# EAGLE schematic espurna-h (EAGLE 8.3.2)
PROJECT_AUTHOR: tinkerman.cat <xose.perez@gmail.com>; PROJECT_LICENSE: CC-BY-SA 4.0; PROJECT_NAME: ESPURNA-H; PROJECT_VERSION: 0.7.20170913
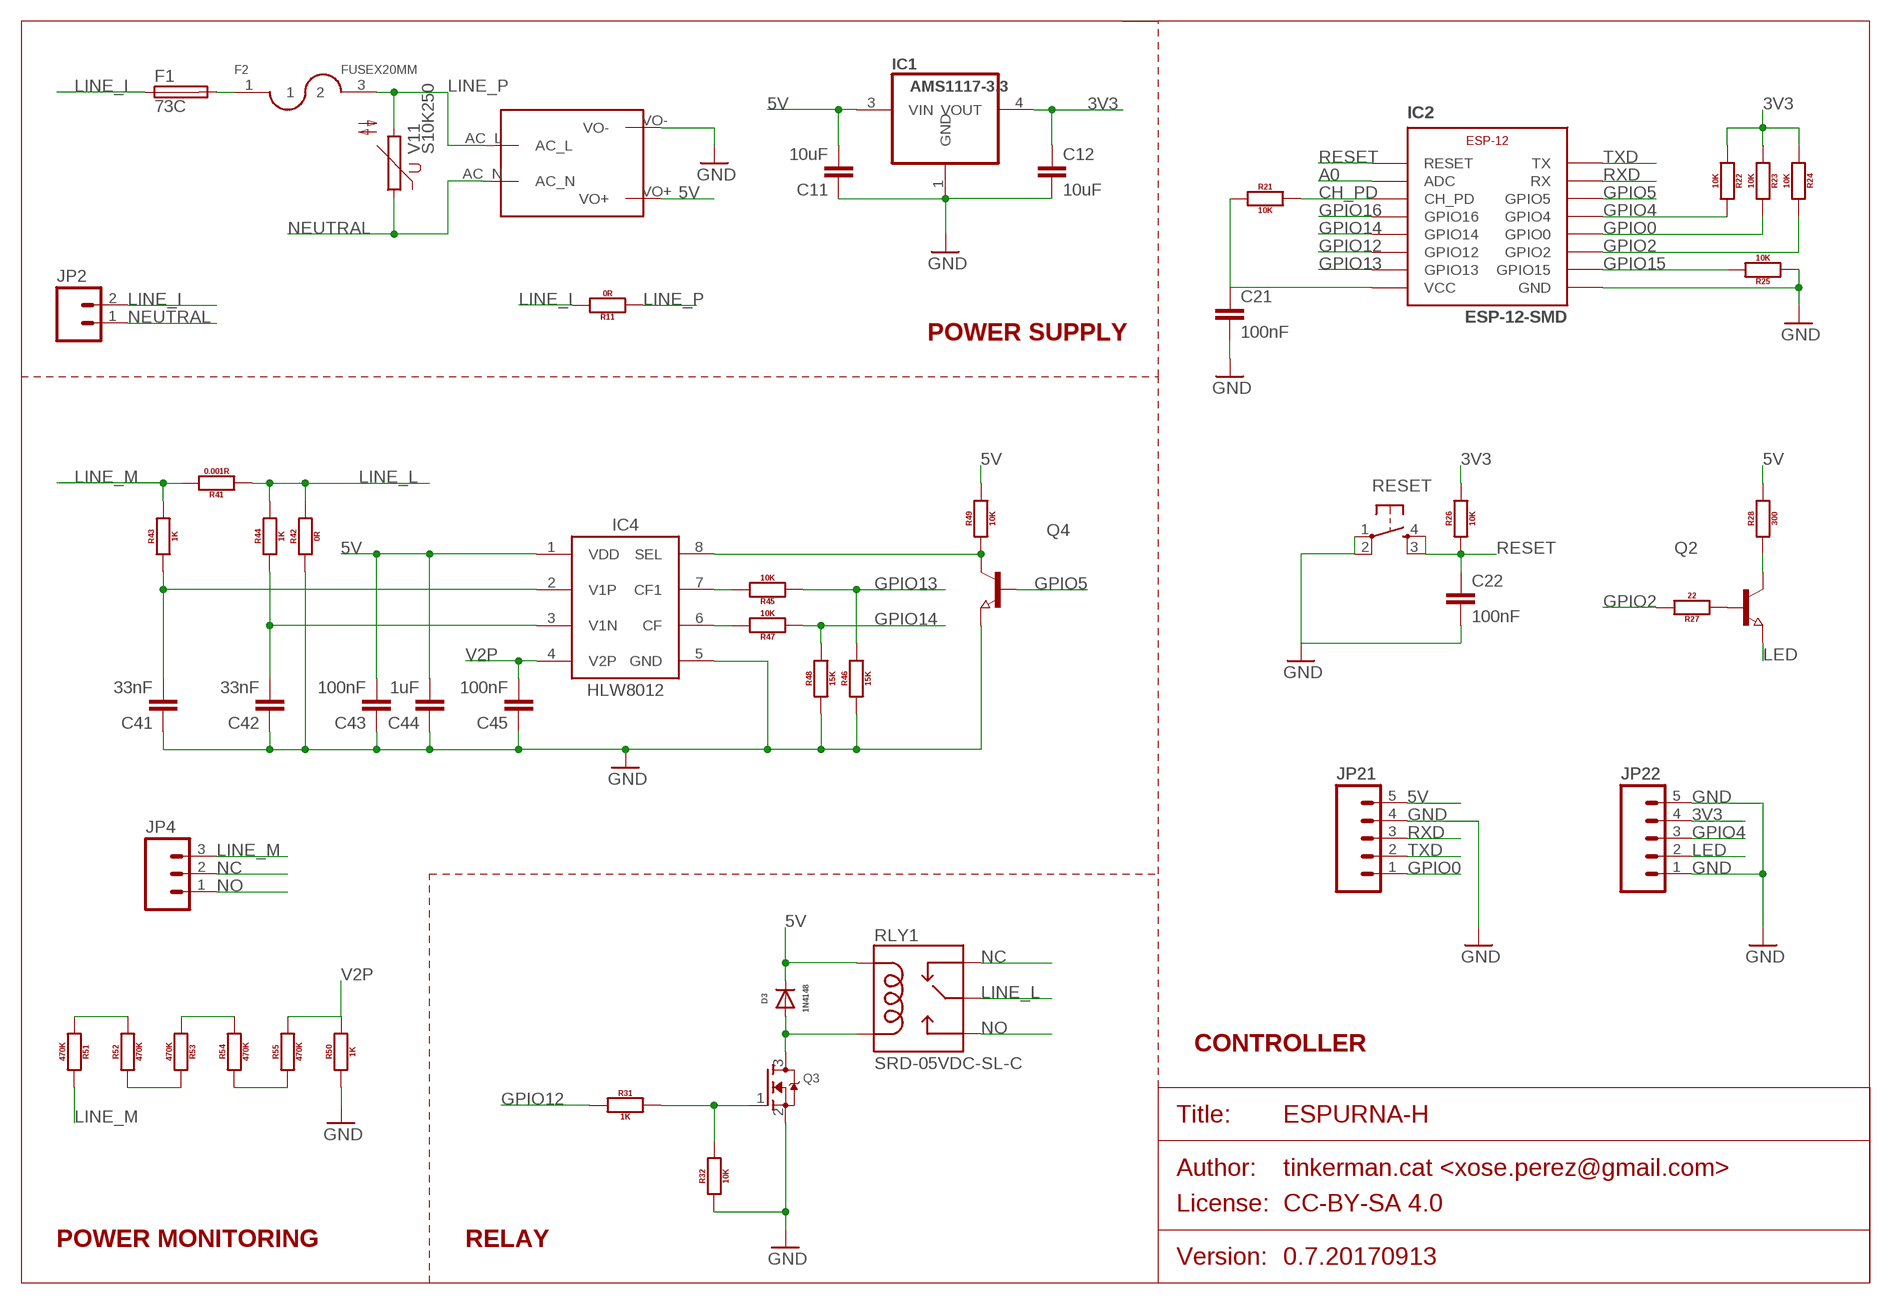
[diagram p0: schematic, sheet 1]

## Parts
C11  10uF  C-EU0805  [0805]
C12  10uF  C-EU0805  [0805]
C21  100nF  C-EU0805  [0805]
C22  100nF  C-EU0805  [0805]
C41  33nF  C-EU0805  [0805]
C42  33nF  C-EU0805  [0805]
C43  100nF  C-EU0805  [0805]
C44  1uF  C-EU0805  [0805]
C45  100nF  C-EU0805  [0805]
D3  1N4148  DIODE  [SOD80]
F1  73C  PICOFUSE  [PICOFUSE]
F2  FUSEX20MM  [FUSE_5MM]
IC1  AMS1117-3.3  REG1117SOT223-2  [SOT223]
IC2  ESP-12-SMD  [ESP-12-SMD]
IC4  HLW8012  [SOP8]
JP2  M02200MIL  [SCREWTERMINAL-200MIL-2]
JP4  M03200MIL  [SCREWTERMINAL-200MIL-3]
JP21  M05PTH  [1X05]
JP22  M05PTH  [1X05]
Q2  NPN-TRANSISTOR_SOT23  [SOT23]
Q3  MOSFET-NREFLOW  [SOT23]
Q4  NPN-TRANSISTOR_SOT23  [SOT23]
R11  0R  RESISTOR1206  [1206]
R21  10K  RESISTOR0805  [0805]
R22  10K  RESISTOR0805  [0805]
R23  10K  RESISTOR0805  [0805]
R24  10K  RESISTOR0805  [0805]
R25  10K  RESISTOR0805  [0805]
R26  10K  RESISTOR0805  [0805]
R27  22  RESISTOR0805  [0805]
R28  300  RESISTOR0805  [0805]
R31  1K  RESISTOR0805  [0805]
R32  10K  RESISTOR0805  [0805]
R41  0.001R  RESISTOR2512  [2512]
R42  0R  RESISTOR1206  [1206]
R43  1K  RESISTOR0805  [0805]
R44  1K  RESISTOR0805  [0805]
R45  10K  RESISTOR0805  [0805]
R46  15K  RESISTOR0805  [0805]
R47  10K  RESISTOR0805  [0805]
R48  15K  RESISTOR0805  [0805]
R49  10K  RESISTOR0805  [0805]
R50  1K  RESISTOR0805  [0805]
R51  470K  RESISTOR0805  [0805]
R52  470K  RESISTOR0805  [0805]
R53  470K  RESISTOR0805  [0805]
R54  470K  RESISTOR0805  [0805]
R55  470K  RESISTOR0805  [0805]
RESET  TACTILE_BUTTON_SMD  [TACTILE-BUTTON-SMD]
RLY1  SRD-05VDC-SL-C  RELAYSONGLE  [SRD-5VDC-SL-C]
U$1  MAINS_CONVERTERS  [HLK-PM01]
V11  S10K250  [S10K250]

## Nets
3V3: C12.1 C21.1 IC1.4(VOUT) IC2.VCC JP22.4 R21.1 R22.1 R23.1 R24.1 R26.2
5V: C11.2 C43.2 C44.2 D3.2(C) IC1.3(VIN) IC4.1(VDD) JP21.5 R28.2 R49.2 RLY1.COIL1 U$1.VO+
A0: IC2.ADC
CH_PD: IC2.CH_PD R21.2
GND: C11.1 C12.2 C21.2 C22.2 C41.1 C42.1 C43.1 C44.1 C45.1 IC1.1(GND) IC2.GND IC4.5(GND) JP21.4 JP22.1 JP22.5 Q3.2(S) Q4.2(E) R25.1 R32.1 R42.1 R46.1 R48.1 R50.1 RESET.1(SWA1) RESET.2(SWB1) U$1.VO-
GPIO0: IC2.GPIO0 JP21.1 R23.2
GPIO2: IC2.GPIO2 R24.2 R27.2
GPIO4: IC2.GPIO4 JP22.3 R22.2
GPIO5: IC2.GPIO5 Q4.1(B)
GPIO12: IC2.GPIO12 R31.1
GPIO13: IC2.GPIO13 R45.1 R46.2
GPIO14: IC2.GPIO14 R47.1 R48.2
GPIO15: IC2.GPIO15 R25.2
GPIO16: IC2.GPIO16
LED: JP22.2 Q2.2(E)
LINE_I: F1.1 JP2.2 R11.2
LINE_L: R41.1 R42.2 R44.2 RLY1.COMMON(MAIN)
LINE_M: JP4.3 R41.2 R43.2 R51.2
LINE_P: F2.3 R11.1 U$1.AC_L V11.2
N$1: Q2.3(C) R28.1
N$3: Q2.1(B) R27.1
N$4: D3.1(A) Q3.3(D) RLY1.COIL2
N$5: Q3.1(G) R31.2 R32.2
N$6: R54.1 R55.1
N$7: F1.2 F2.1
N$10: IC4.8(SEL) Q4.3(C) R49.1
N$11: IC4.7(CF1) R45.2
N$12: C41.2 IC4.2(V1P) R43.1
N$13: IC4.6(CF) R47.2
N$14: C42.2 IC4.3(V1N) R44.1
N$15: R51.1 R52.2
N$16: R52.1 R53.2
N$17: R53.1 R54.2
NC: JP4.2 RLY1.CLOSED(NC)
NEUTRAL: JP2.1 U$1.AC_N V11.1
NO: JP4.1 RLY1.OPEN(NO)
RESET: C22.1 IC2.RESET R26.1 RESET.3(SWB2) RESET.4(SWA2)
RXD: IC2.RX JP21.3
TXD: IC2.TX JP21.2
V2P: C45.2 IC4.4(V2P) R50.2 R55.2

## Notes on the sheet
- POWER SUPPLY
- CONTROLLER
- POWER MONITORING | RELAY

## Library data of the parts
C11 C12 C21 C22 C41-C45 = xose:C-EU: CAPACITOR, European symbol
D3 = xose:DIODE
F1 = fuse:PICOFUSE: PICOFUSE 19275, Wickmann
F2 = xose:FUSE
IC1 = xose:REG1117: 800mA and 1A Low Dropout (LDO) Positive Regulator 1.8V, 2.5V, 2.85V, 3.3V, 5V, and Adj
IC2 = xose:ESP-12
IC4 = xose:HLW8012
JP2 = xose:M02: Standard 2-pin 0.1" header. Use with - straight break away headers ( PRT-00116) - right angle break away headers (PRT-00553) - swiss pins (PRT-00743) - machine pins (PRT-00117) - female headers (PRT-00115) Molex polarized connector foot print use with: PRT-08233 with associated crimp pins and housings. 2.54_SCREWTERM for use with PRT-10571. 3.5mm Screw Terminal footprints for PRT-08084 5mm Screw Terminal footprints for use with PRT-08432
JP4 = xose:M03: Header 3 Standard 3-pin 0.1" header. Use with straight break away headers (SKU : PRT-00116), right angle break away headers (PRT-00553), swiss pins (PRT-00743), machine pins (PRT-00117), and female headers (PRT-00115). Molex polarized connector foot print use with SKU : PRT-08232 with associated crimp pins and housings.
JP21 JP22 = xose:M05: Header 5 Standard 5-pin 0.1" header. Use with straight break away headers (SKU : PRT-00116), right angle break away headers (PRT-00553), swiss pins (PRT-00743), machine pins (PRT-00117), and female headers (PRT-00115). Molex polarized connector foot print use with SKU : PRT-08230 with associated crimp pins and housings.
Q2 Q4 = xose:NPN-TRANSISTOR_: NPN TRANSISTOR
Q3 = xose:MOSFET-N: N-Channel Mosfet 2N7002E - 60V 260mA SOT23 [Digikey: 2N7002ET1GOSTR-ND] - REEL BSH103 - 30V 850mA SOT23 [Digikey: 568-5013-1-ND]
R11 R21-R28 R31 R32 R41-R55 = xose:RESISTOR: Generic EU resistor symbol
RESET = xose:TACTILE_BUTTON: Tactile Button SparkFun Electronics' Tactile Button COM-10302
RLY1 = Spark:RELAY: SPDT relay (COM-00101)
U$1 = captain-slow:MAINS_CONVERTERS
V11 = xose:S10K250: VARISTOR